# EAGLE schematic neato (EAGLE 7.5.0)
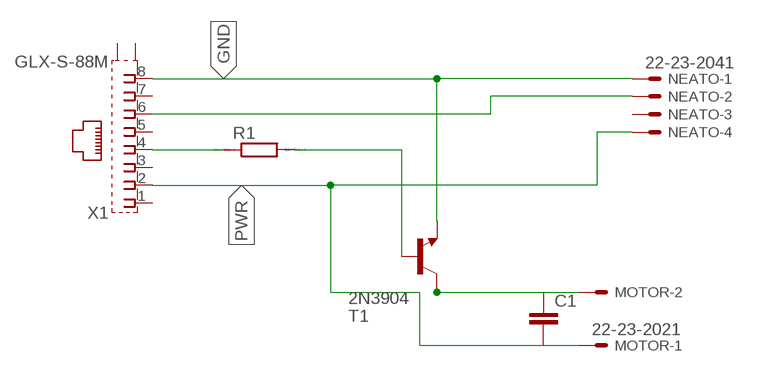
[diagram p0: schematic, sheet 1]

## Parts
C1  C2,5-3  [C2.5-3]
MOTOR  22-23-2021  [22-23-2021]
NEATO  22-23-2041  [22-23-2041]
R1  R0207/10  [0207/10]
T1  2N3904  [TO92]
X1  GLX-S-88M  [GLX-S-88M]

## Nets
GND: NEATO.1 T1.3(E) X1.8
N$2: C1.1 MOTOR.2 T1.1(C)
N$3: R1.1 X1.4
N$5: NEATO.2 X1.6
N$6: R1.2 T1.2(B)
PWR: C1.2 MOTOR.1 NEATO.4 X1.2
Unconnected: NEATO.3 X1.1 X1.3 X1.5 X1.7 X1.S1 X1.S2

## Library data of the parts
C1 = capacitor-wima:C: CAPACITOR naming: grid - package width
MOTOR = con-molex:22-23-2021: .100" (2.54mm) Center Header - 2 Pin; MF: MOLEX; MPN: 22-23-2021; OC_FARNELL: 1462926; OC_NEWARK: 25C3832
NEATO = con-molex:22-23-2041: .100" (2.54mm) Center Header - 4 Pin; MF: MOLEX; MPN: 22-23-2041; OC_FARNELL: 1462920; OC_NEWARK: 38C0355
R1 = eagle-ltspice:R: RESISTOR, European symbol; SPICEMODEL: NONE; SPICEPREFIX: R
T1 = transistor:2N3904: NPN TRANSISTOR
X1 = con-kycon:GLX-S-88M: Mod. Jack, Right Angle, 8 posiotion, 8 contatcs RJ45 Source: GLX-S-88M.pdf; OC_FARNELL: unknown; OC_NEWARK: unknown

## Net classes
0 default: clearance 0.205 mm